# Altium schematic sheet 20190520508李柯烨电路图.schdoc
size 302 x 211 mm
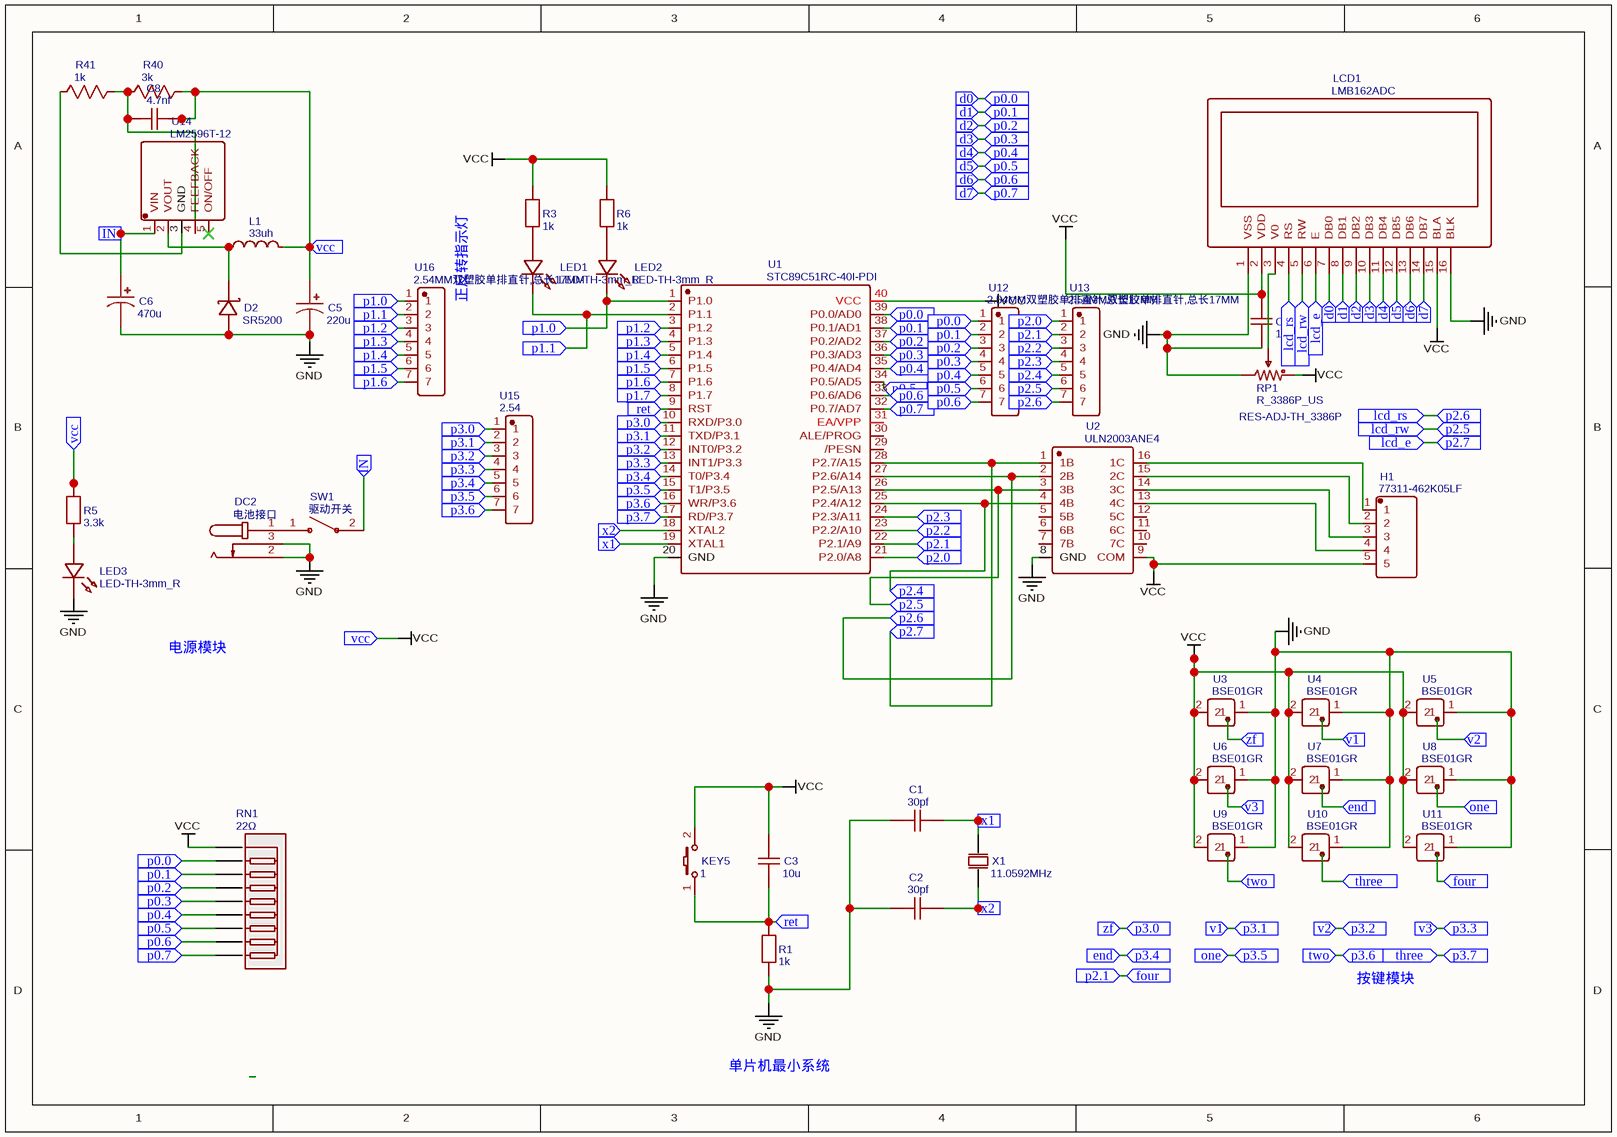
[diagram p0: 20190520508李柯烨电路图.schdoc]

## Parts
C1  30pf  [RAD-0.1]
C2  30pf  [RAD-0.1]
C3  10u  [RAD-0.1]
C4  104  [RAD-0.1]
C5  220u  [L_CAP-D10.0×F5.0]
C6  470u  [L_CAP-D10.0×F5.0]
C8  4.7nf  [RAD-0.2]
D2  SR5200  [DO-201AD_BD5.3-L8.4-P12.50-D1.4-RD]
DC2  电池接口  [DC-IN-TH_DC005-T]
H1  77311-462K05LF  [HDR-TH_5P-P2.54-V-M]
KEY5  1  [KEY-SMD_2P-L6.2-W3.6-LS8.0]
L1  33uh  [L_AXIAL-0.4]
LCD1  LMB162ADC  [LCD1602]
LED1  LED-TH-3mm_R  [LED-TH_BD3.0_RED]
LED2  LED-TH-3mm_R  [LED-TH_BD3.0_RED]
LED3  LED-TH-3mm_R  [LED-TH_BD3.0_RED]
R1  1k  [R_AXIAL-0.4]
R3  1k  [R_AXIAL-0.4]
R5  3.3k  [R_AXIAL-0.4]
R6  1k  [R_AXIAL-0.4]
R40  3k  [R_AXIAL-0.4]
R41  1k  [R_AXIAL-0.4]
RN1  22Ω  [RES-ARRAY-TH_9P-P2.54-D1.0]
RP1  R_3386P_US  [RES-ADJ-TH_3386P]
SW1  驱动开关  [船形开关.两脚.两档]
U1  STC89C51RC-40I-PDI  [DIP-40_L52.3-W13.9-P2.54-LS15.2-BL]
U2  ULN2003ANE4  [DIP16]
U3  BSE01GR  [SW-TH_1P_BSE01GR]
U4  BSE01GR  [SW-TH_1P_BSE01GR]
U5  BSE01GR  [SW-TH_1P_BSE01GR]
U6  BSE01GR  [SW-TH_1P_BSE01GR]
U7  BSE01GR  [SW-TH_1P_BSE01GR]
U8  BSE01GR  [SW-TH_1P_BSE01GR]
U9  BSE01GR  [SW-TH_1P_BSE01GR]
U10  BSE01GR  [SW-TH_1P_BSE01GR]
U11  BSE01GR  [SW-TH_1P_BSE01GR]
U12  2.54MM双塑胶单排直针,总长17MM  [HDR-TH_7P-P2.54-V-F_2.54MM-17MM]
U13  2.54MM双塑胶单排直针,总长17MM  [HDR-TH_7P-P2.54-V-F_2.54MM-17MM]
U14  LM2596T-12  [TO-220-5L_L10.2-W4.5-P1.71-L]
U15  2.54  [HDR-TH_7P-P2.54-V-F_2.54MM-17MM]
U16  2.54MM双塑胶单排直针,总长17MM  [HDR-TH_7P-P2.54-V-F_2.54MM-17MM]
X1  11.0592MHz  [OSC-TH_L10.0-W4.5-P5.00]

## Ports
d0 (in), d1 (in), d2 (in), d3 (in), d4 (in), d5 (in), d6 (in), d7 (in), end (in), four (in), IN (in), lcd_e (in), lcd_rs (in), lcd_rw (in), one (in), p0.0 (in), p0.1 (in), p0.2 (in), p0.3 (in), p0.4 (in), p0.5 (in), p0.6 (in), p0.7 (in), p1.0 (in), p1.1 (in), p1.2 (in), p1.3 (in), p1.4 (in), p1.5 (in), p1.6 (in), p1.7 (in), p2.0 (in), p2.1 (in), p2.2 (in), p2.3 (in), p2.4 (in), p2.5 (in), p2.6 (in), p2.7 (in), p3.0 (in), p3.1 (in), p3.2 (in), p3.3 (in), p3.4 (in), p3.5 (in), p3.6 (in), p3.7 (in), ret (in), three (in), two (in), v1 (in), v2 (in), v3 (in), vcc (in), x1 (in), x2 (in), zf (in)

## Nets
GND: C1.1 C2.1 C4.1 C5.2 C6.2 D2.2(A) DC2.2 DC2.3 LCD1.1(VSS) LCD1.16(BLK) LED3.2 R1.1 RP1.3 U1.20(GND) U2.8(GND) U3.1 U4.1 U5.1 U6.1 U7.1 U8.1 U9.1 U10.1 U11.1
VCC: C3.2 C4.2 C5.1 C8.2 H1.5 KEY5.2 L1.2 LCD1.2(VDD) LCD1.15(BLA) R3.2 R5.1 R6.2 R40.2 RN1.1 RP1.1 U1.40(VCC) U2.9(COM) U3.2 U4.2 U5.2 U6.2 U7.2 U8.2 U9.2 U10.2 U11.2 ; port vcc
d0: LCD1.7(DB0) RN1.2 U1.39(P0.0/AD0) U12.1 ; port d0, port p0.0
d1: LCD1.8(DB1) RN1.3 U1.38(P0.1/AD1) U12.2 ; port d1, port p0.1
d2: LCD1.9(DB2) RN1.4 U1.37(P0.2/AD2) U12.3 ; port d2, port p0.2
d3: LCD1.10(DB3) RN1.5 U1.36(P0.3/AD3) U12.4 ; port d3, port p0.3
d4: LCD1.11(DB4) RN1.6 U1.35(P0.4/AD4) U12.5 ; port d4, port p0.4
d5: LCD1.12(DB5) RN1.7 U1.34(P0.5/AD5) U12.6 ; port d5, port p0.5
d6: LCD1.13(DB6) RN1.8 U1.33(P0.6/AD6) U12.7 ; port d6, port p0.6
d7: LCD1.14(DB7) RN1.9 U1.32(P0.7/AD7) ; port d7, port p0.7
end: U1.14(T0/P3.4) U15.5 ; port p3.4, port end
four: U1.22(P2.1/A9) U13.2 ; port p2.1, port four
IN: C6.1 SW1.2 U14.1(VIN) ; port IN
lcd_e: LCD1.6(E) U1.28(P2.7/A15) U2.1(1B) ; port lcd_e, port p2.7
lcd_rs: LCD1.4(RS) U1.27(P2.6/A14) U2.2(2B) U13.7 ; port lcd_rs, port p2.6
lcd_rw: LCD1.5(RW) U1.26(P2.5/A13) U2.3(3B) U13.6 ; port lcd_rw, port p2.5
one: U1.15(T1/P3.5) U15.6 ; port p3.5, port one
p1.0: LED2.2 U1.1(P1.0) U16.1 ; port p1.0
p1.1: LED1.2 U1.2(P1.1) U16.2 ; port p1.1
p1.2: U1.3(P1.2) U16.3 ; port p1.2
p1.3: U1.4(P1.3) U16.4 ; port p1.3
p1.4: U1.5(P1.4) U16.5 ; port p1.4
p1.5: U1.6(P1.5) U16.6 ; port p1.5
p1.6: U1.7(P1.6) U16.7 ; port p1.6
p1.7: U1.8(P1.7) ; port p1.7
p2.0: U1.21(P2.0/A8) U13.1 ; port p2.0
p2.2: U1.23(P2.2/A10) U13.3 ; port p2.2
p2.3: U1.24(P2.3/A11) U13.4 ; port p2.3
p2.4: U1.25(P2.4/A12) U2.4(4B) U13.5 ; port p2.4
p3.0: U1.10(RXD/P3.0) U15.1 ; port p3.0, port zf
p3.1: U1.11(TXD/P3.1) U15.2 ; port p3.1, port v1
p3.2: U1.12(INT0/P3.2) U15.3 ; port p3.2, port v2
p3.3: U1.13(INT1/P3.3) U15.4 ; port p3.3, port v3
p3.6: U1.16(WR/P3.6) U15.7 ; port p3.6, port two
p3.7: U1.17(RD/P3.7) ; port p3.7, port three
ret: C3.1 KEY5.1 R1.2 U1.9(RST) ; port ret
x1: C1.2 U1.19(XTAL1) X1.1(OSC1) ; port x1
x2: C2.2 U1.18(XTAL2) X1.2(OSC2) ; port x2
NetC8_1: C8.1 R40.1 R41.2 U14.4(FEEFBACK)
NetD2_1: D2.1(C) L1.1 U14.2(VOUT)
NetDC2_1: DC2.1 SW1.1
NetH1_1: H1.1 U2.16(1C)
NetH1_2: H1.2 U2.15(2C)
NetH1_3: H1.3 U2.14(3C)
NetH1_4: H1.4 U2.13(4C)
NetLCD1_3: LCD1.3(V0) RP1.2
NetLED1_1: LED1.1 R3.1
NetLED2_1: LED2.1 R6.1
NetLED3_1: LED3.1 R5.2
NetR41_1: R41.1 U14.3(GND)

Not connected (* = marked no-connect by the designer): U1 29(/PESN) 30(ALE/PROG) 31(EA/VPP); U2 5(5B) 6(6B) 7(7B) 10(7C) 11(6C) 12(5C); U14 5(ON/OFF)*

## Notes on the sheet
- (near U16) 正反转指示灯
- 电源模块
- 按键模块
- 单片机最小系统
- (in symbol R_3386P_US) RES-ADJ-TH_3386P

## Library data of the parts
C1 C2 = 30pf: nameAlias: Value(F); Contributor: LCEDA_Lib; spicePre: C; spiceSymbolName: C_RAD-0.1_US
C3 = 10u: nameAlias: Value(F); Contributor: LCEDA_Lib; spicePre: C; spiceSymbolName: C_RAD-0.1_US
C4 = 104: nameAlias: Value(F); Contributor: LCEDA_Lib; spicePre: C; spiceSymbolName: C_RAD-0.1_US
C5 = 220u: nameAlias: Value(F); Contributor: LCEDA_Lib; spicePre: C; spiceSymbolName: C_Tan_SMD_A_US
C6 = 470u: nameAlias: Value(F); Contributor: LCEDA_Lib; spicePre: C; spiceSymbolName: C_Tan_SMD_A_US
C8 = 4.7nf: nameAlias: Value(F); Contributor: LCEDA_Lib; spicePre: C; spiceSymbolName: C_RAD-0.2_US
D2 = SR5200: BOM_Manufacturer: DYELEC; Contributor: LCSC; BOM_Supplier: LCSC; BOM_Manufacturer Part: SR5200; BOM_Supplier Part: C129841; BOM_JLCPCB Part Class: Extended Part; spicePre: D; spiceSymbolName: SR5200
DC2 = 电池接口: BOM_Manufacturer: XKB Enterprise; BOM_Manufacturer Part: DC-002H-1.3; Contributor: LCSC; BOM_Supplier: LCSC; BOM_Supplier Part: C319138; BOM_JLCPCB Part Class: Extended Part; spicePre: D; spiceSymbolName: DC-002H-1.3
H1 = 77311-462K05LF: BOM_Manufacturer: Amphenol; Contributor: LCSC; BOM_Supplier: LCSC; BOM_Supplier Part: C180219; BOM_Manufacturer Part: 77311-462K05LF; spicePre: H; spiceSymbolName: 77311-462K05LF
KEY5 = 1: BOM_Manufacturer Part: K2-1107ST-A4SW-06; Contributor: LCEDA_Lib; 制造商: 韩国韩荣; Package Display: No; BOM_Supplier Part: C118141; BOM_Supplier: LCSC; spicePre: K; spiceSymbolName: K2-3.6×6.1_SMD
L1 = 33uh: nameAlias: Value(H); Contributor: LCEDA_Lib; spicePre: L; spiceSymbolName: L_AXIAL-0.4_US
LCD1 = LMB162ADC: BOM_Manufacturer: TOPWAY; BOM_Supplier: LCSC; BOM_Manufacturer Part: LMB162ADC; BOM_Supplier Part: C9741; BOM_JLCPCB Part Class: Extended Part; spicePre: L; spiceSymbolName: LMB162ADC
LED1-LED3 = LED-TH-3mm_R: BOM_Manufacturer: EVERLIGHT(台湾亿光); BOM_Manufacturer Part: 204-10SDRD/S530-A3-L; Contributor: LCEDA_Lib; BOM_Supplier Part: C84774; BOM_Supplier: LCSC; spicePre: L; spiceSymbolName: LED-TH-3mm_R
R1 R3 R6 R41 = 1k: nameAlias: Value(Ω); Contributor: LCEDA_Lib; spicePre: R
  R1 R3 R6: spiceSymbolName: R_AXIAL-0.4_EU
  R41: spiceSymbolName: R_AXIAL-0.4_US
R5 = 3.3k: nameAlias: Value(Ω); Contributor: LCEDA_Lib; spicePre: R; spiceSymbolName: R_AXIAL-0.4_EU
R40 = 3k: nameAlias: Value(Ω); Contributor: LCEDA_Lib; spicePre: R; spiceSymbolName: R_AXIAL-0.4_US
RN1 = 22Ω: BOM_Manufacturer: FH(风华); BOM_Manufacturer Part: A09-220JP; nameAlias: Resistance; Resistance (Ohms): 22; BOM_Supplier: LCSC; BOM_Supplier Part: C9105; BOM_JLCPCB Part Class: Extended Part; spicePre: R; spiceSymbolName: A09-220JP
RP1 = R_3386P_US: nameAlias: Value; Contributor: LCEDA_Lib; BOM_value(Ω): 10K; Package Display: Yes; BOM_Supplier: LCSC; spicePre: R; spiceSymbolName: R_3386P_US
SW1 = 驱动开关: BOM_Manufacturer: ROCKTEK; BOM_Manufacturer Part: RT-S01-145-L1NB1B; Contributor: LCSC; BOM_Supplier: LCSC; BOM_Supplier Part: C312627; BOM_JLCPCB Part Class: Extended Part; spicePre: S; spiceSymbolName: RT-S01-145-L1NB1B
U1 = STC89C51RC-40I-PDI: BOM_Manufacturer: STC(宏晶); BOM_Manufacturer Part: STC89C51RC-40I-PDIP40; BOM_Supplier: LCSC; BOM_Supplier Part: C29286; BOM_JLCPCB Part Class: Extended Part; spicePre: U; spiceSymbolName: STC89C51RC-40I-PDI
U3-U11 = BSE01GR: BOM_Manufacturer: BIWIN(百莹); Contributor: lcsc; BOM_Supplier: LCSC; BOM_Supplier Part: C3294680; BOM_Manufacturer Part: BSE01GR; link: https://atta.szlcsc.com/upload/public/pdf/source/20220704/68EC58D568F4CB414697417357FBEBEB.pdf; spicePre: U; spiceSymbolName: BSE01GR
U12 U13 U16 = 2.54MM双塑胶单排直针,总长17MM: BOM_Manufacturer: null; Contributor: LCSC; BOM_Supplier: LCSC; BOM_Supplier Part: C9900001323; BOM_Manufacturer Part: 2.54mm双塑胶单排直针,总长17mm; BOM_JLCPCB Part Class: Extended Part; link: https://item.taobao.com/item.htm?spm=a230r.1.14.144.9d6d1a15tWERo5&id=614833398299&ns=1&abbucket=18#detail; spicePre: U; spiceSymbolName: 2.54MM双塑胶单排直针,总长17MM
U14 = LM2596T-12: BOM_Manufacturer: HTC; Contributor: LCSC; BOM_Supplier: LCSC; BOM_Manufacturer Part: LM2596T-12; BOM_Supplier Part: C126045; BOM_JLCPCB Part Class: Extended Part; spicePre: U; spiceSymbolName: LM2596T-12
U15 = 2.54: BOM_Manufacturer Part: 2.54mm双塑胶单排直针,总长17mm; BOM_Manufacturer: null; Contributor: LCSC; BOM_Supplier: LCSC; BOM_Supplier Part: C9900001323; BOM_JLCPCB Part Class: Extended Part; link: https://item.taobao.com/item.htm?spm=a230r.1.14.144.9d6d1a15tWERo5&id=614833398299&ns=1&abbucket=18#detail; spicePre: U; spiceSymbolName: 2.54MM双塑胶单排直针,总长17MM
X1 = 11.0592MHz: BOM_Manufacturer: YXC; BOM_Manufacturer Part: X49UD110592MSD2SC; nameAlias: Frequency; BOM_Supplier: LCSC; BOM_Supplier Part: C2194; spicePre: X; spiceSymbolName: X49UD110592MSD2SC
U2 = ULN2003ANE4: spicePre: X; spiceSymbolName: ULN2003ANE4